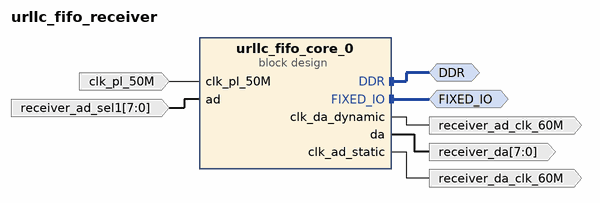
[diagram p0: block diagram of the top level]
# Vivado block design urllc_fifo_receiver, xc7z020clg400-2, Vivado 2021.1
create_bd_design urllc_fifo_receiver

create_bd_intf_port -mode Master -vlnv xilinx.com:interface:ddrx_rtl:1.0 DDR
create_bd_intf_port -mode Master -vlnv xilinx.com:display_processing_system7:fixedio_rtl:1.0 FIXED_IO
create_bd_port -dir I -type clk clk_pl_50M
set_property -dict {CONFIG.FREQ_HZ 50000000} [get_bd_ports clk_pl_50M]
create_bd_port -dir I -from 7 -to 0 -type data receiver_ad_sel1
create_bd_port -dir O -type clk receiver_ad_clk_60M
create_bd_port -dir O -from 7 -to 0 -type data receiver_da
create_bd_port -dir O -type clk receiver_da_clk_60M

create_bd_cell -type container -reference urllc_fifo_core urllc_fifo_core_0
set_property -dict [list \
  CONFIG.ACTIVE_SIM_BD urllc_fifo_core.bd \
  CONFIG.ACTIVE_SYNTH_BD urllc_fifo_core.bd \
  CONFIG.ENABLE_DFX 0 \
  CONFIG.LIST_SIM_BD urllc_fifo_core.bd \
  CONFIG.LIST_SYNTH_BD urllc_fifo_core.bd \
  CONFIG.LOCK_PROPAGATE 0 \
] [get_bd_cells urllc_fifo_core_0]

# ---- connections ----

connect_bd_intf_net [get_bd_intf_ports DDR] [get_bd_intf_pins urllc_fifo_core_0/DDR]
connect_bd_intf_net [get_bd_intf_ports FIXED_IO] [get_bd_intf_pins urllc_fifo_core_0/FIXED_IO]
connect_bd_net [get_bd_ports clk_pl_50M] [get_bd_pins urllc_fifo_core_0/clk_pl_50M]
connect_bd_net -net receiver_ad_sel1_1 [get_bd_ports receiver_ad_sel1] [get_bd_pins urllc_fifo_core_0/ad]
connect_bd_net [get_bd_pins urllc_fifo_core_0/clk_ad_static] [get_bd_ports receiver_da_clk_60M]
connect_bd_net [get_bd_pins urllc_fifo_core_0/clk_da_dynamic] [get_bd_ports receiver_ad_clk_60M]
connect_bd_net [get_bd_pins urllc_fifo_core_0/da] [get_bd_ports receiver_da]

# ---- address map ----
assign_bd_address -offset 0x00000000 -range 256M -target_address_space [get_bd_addr_spaces urllc_fifo_core_0/core/axi_dma_0/Data_MM2S] [get_bd_addr_segs urllc_fifo_core_0/core/processing_system7_0/S_AXI_HP0/HP0_DDR_LOWOCM]
assign_bd_address -offset 0x10000000 -range 256M -target_address_space [get_bd_addr_spaces urllc_fifo_core_0/core/axi_dma_0/Data_MM2S] [get_bd_addr_segs urllc_fifo_core_0/core/processing_system7_0/S_AXI_HP1/HP1_DDR_LOWOCM]
assign_bd_address -offset 0x00000000 -range 256M -target_address_space [get_bd_addr_spaces urllc_fifo_core_0/core/axi_dma_0/Data_S2MM] [get_bd_addr_segs urllc_fifo_core_0/core/processing_system7_0/S_AXI_HP0/HP0_DDR_LOWOCM]
assign_bd_address -offset 0x10000000 -range 256M -target_address_space [get_bd_addr_spaces urllc_fifo_core_0/core/axi_dma_0/Data_S2MM] [get_bd_addr_segs urllc_fifo_core_0/core/processing_system7_0/S_AXI_HP1/HP1_DDR_LOWOCM]
assign_bd_address -offset 0x40400000 -range 64K -target_address_space [get_bd_addr_spaces urllc_fifo_core_0/core/processing_system7_0/Data] [get_bd_addr_segs urllc_fifo_core_0/core/axi_dma_0/S_AXI_LITE/Reg]
assign_bd_address -offset 0x41200000 -range 64K -target_address_space [get_bd_addr_spaces urllc_fifo_core_0/core/processing_system7_0/Data] [get_bd_addr_segs urllc_fifo_core_0/debug_ctrl/axi_gpio_0/S_AXI/Reg]

validate_bd_design
save_bd_design
